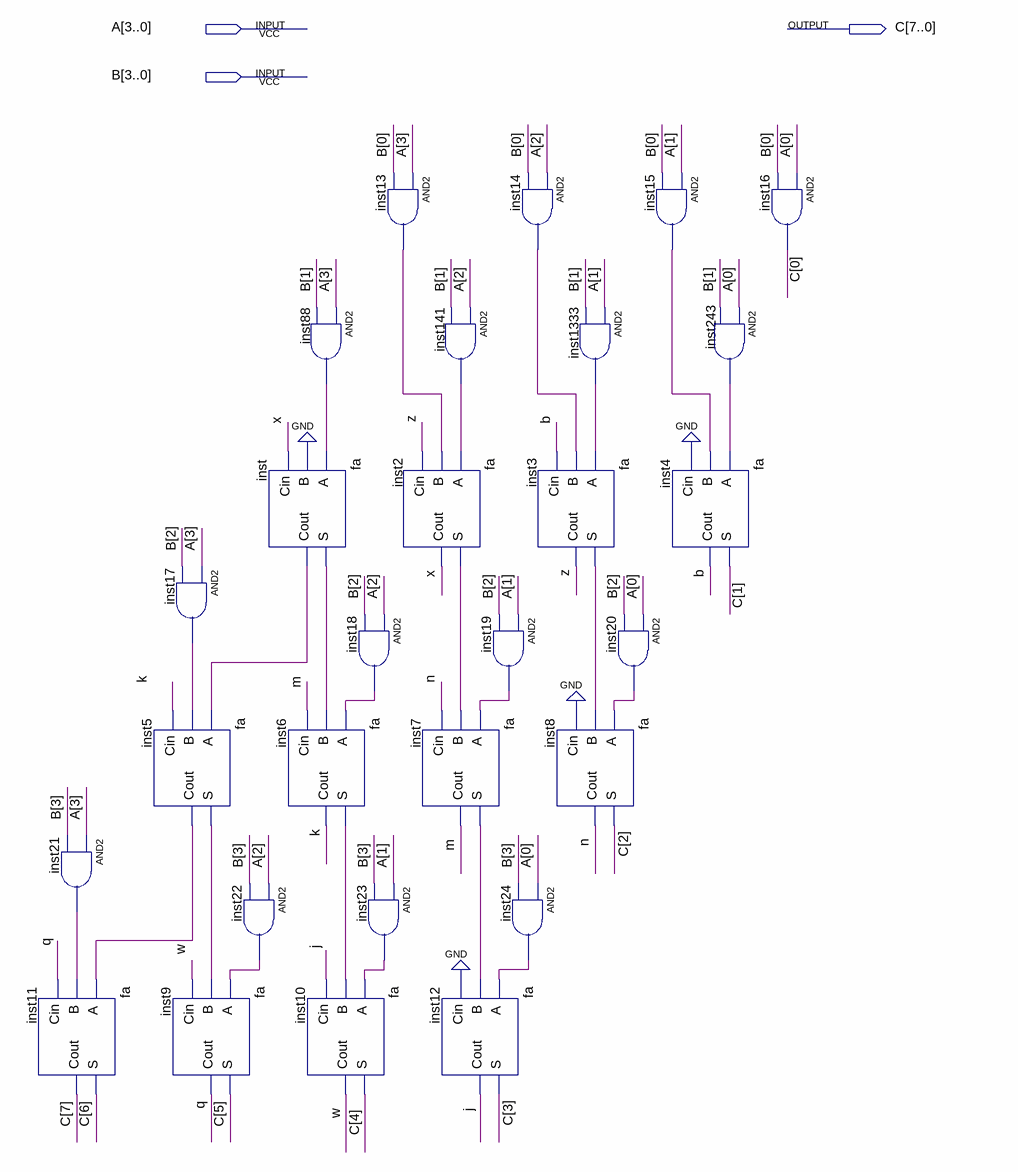
[diagram p0: schematic sheet]
// Quartus schematic mult.bdf as structural Verilog: 28 symbols, 3 pins
module mult (
  input  [3:0] A,
  input  [3:0] B,
  output [7:0] C
);

  wire B_1bit, inst2_s, inst3_s, inst5_cout, inst5_s, inst6_s, inst7_s, inst13_out, inst14_out, inst15_out,
       inst17_out, inst18_out, inst19_out, inst20_out, inst21_out, inst22_out, inst23_out, inst24_out,
       inst88_out, inst141_out, inst243_out, inst1333_out, inst_cout, inst_s, j, k, m, n, q, w, x, z;

  and inst21 (inst21_out, A[3], B[3]);
  fa inst11 (.A(inst5_cout), .B(inst21_out), .Cin(q), .S(C[6]), .Cout(C[7]));
  fa inst5 (.A(inst_cout), .B(inst17_out), .Cin(k), .S(inst5_s), .Cout(inst5_cout));
  and inst17 (inst17_out, A[3], B[2]);
  fa inst9 (.A(inst22_out), .B(inst5_s), .Cin(w), .S(C[5]), .Cout(q));
  and inst88 (inst88_out, A[3], B[1]);
  fa inst (.A(inst88_out), .B(1'b0), .Cin(x), .S(inst_s), .Cout(inst_cout));
  fa inst6 (.A(inst18_out), .B(inst_s), .Cin(m), .S(inst6_s), .Cout(k));
  and inst22 (inst22_out, A[2], B[3]);
  fa inst10 (.A(inst23_out), .B(inst6_s), .Cin(j), .S(C[4]), .Cout(w));
  and inst13 (inst13_out, A[3], B[0]);
  and inst18 (inst18_out, A[2], B[2]);
  and inst23 (inst23_out, A[1], B[3]);
  and inst141 (inst141_out, A[2], B[1]);
  fa inst2 (.A(inst141_out), .B(inst13_out), .Cin(z), .S(inst2_s), .Cout(x));
  fa inst7 (.A(inst19_out), .B(inst2_s), .Cin(n), .S(inst7_s), .Cout(m));
  fa inst12 (.A(inst24_out), .B(inst7_s), .Cin(1'b0), .S(C[3]), .Cout(j));
  and inst14 (inst14_out, A[2], B[0]);
  fa inst3 (.A(inst1333_out), .B(inst14_out), .Cin(B_1bit), .S(inst3_s), .Cout(z));
  and inst19 (inst19_out, A[1], B[2]);
  and inst24 (inst24_out, A[0], B[3]);
  and inst1333 (inst1333_out, A[1], B[1]);
  and inst20 (inst20_out, A[0], B[2]);
  fa inst8 (.A(inst20_out), .B(inst3_s), .Cin(1'b0), .S(C[2]), .Cout(n));
  and inst15 (inst15_out, A[1], B[0]);
  fa inst4 (.A(inst243_out), .B(inst15_out), .Cin(1'b0), .S(C[1]), .Cout(B_1bit));
  and inst16 (C[0], A[0], B[0]);
  and inst243 (inst243_out, A[0], B[1]);
endmodule
